# Altium schematic sheet 01_Top.SchDoc
size A4; Author: Sasa Karanovic; Organization: Altium Limited; sk_Title: Block diagram; DocumentNumber: 1; Revision: 1.0; SheetNumber: 1; SheetTotal: 5
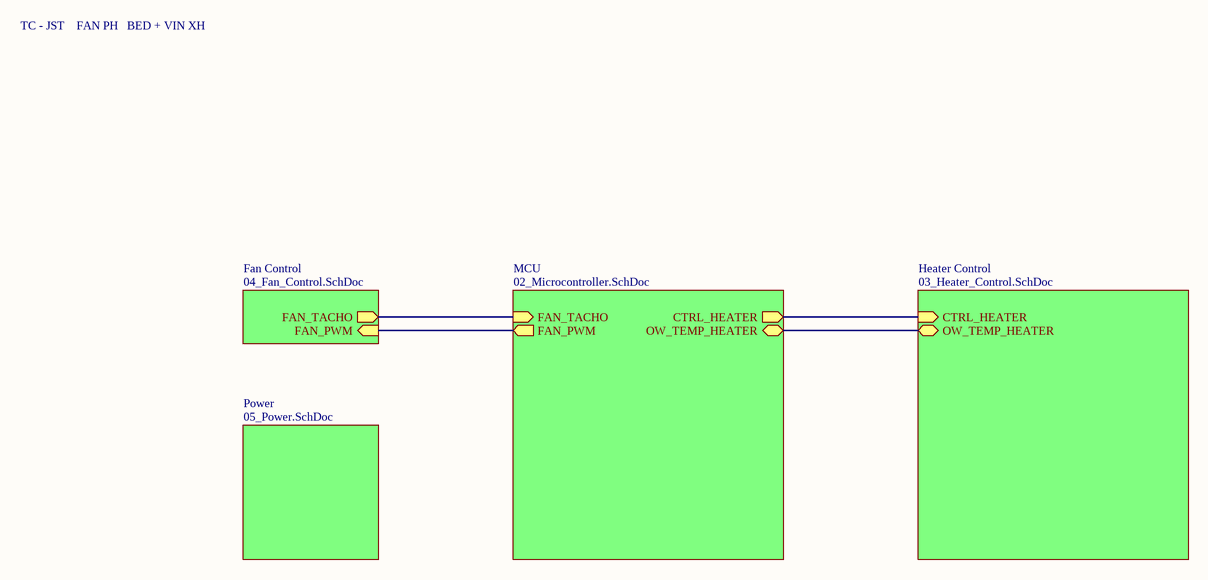
[diagram p0: 01_Top.SchDoc]

## Sub-sheets
Fan Control = 04_Fan_Control.SchDoc: FAN_TACHO (out), FAN_PWM (in)
Heater Control = 03_Heater_Control.SchDoc: CTRL_HEATER (in), OW_TEMP_HEATER (bidir)
MCU = 02_Microcontroller.SchDoc: CTRL_HEATER (out), FAN_TACHO (in), FAN_PWM (out), OW_TEMP_HEATER (bidir)
Power = 05_Power.SchDoc: no entries

## Nets
(unnamed): sheet MCU/CTRL_HEATER, sheet Heater Control/CTRL_HEATER
(unnamed): sheet MCU/FAN_TACHO, sheet Fan Control/FAN_TACHO
(unnamed): sheet MCU/FAN_PWM, sheet Fan Control/FAN_PWM
(unnamed): sheet MCU/OW_TEMP_HEATER, sheet Heater Control/OW_TEMP_HEATER

## Notes on the sheet
- TC - JST    FAN PH   BED + VIN XH
- Page
- Title
- www.SasaKaranovic.com <http://www.SasaKaranovic.com>
- of